# EAGLE schematic electronica-dextris (EAGLE 9.0.1)
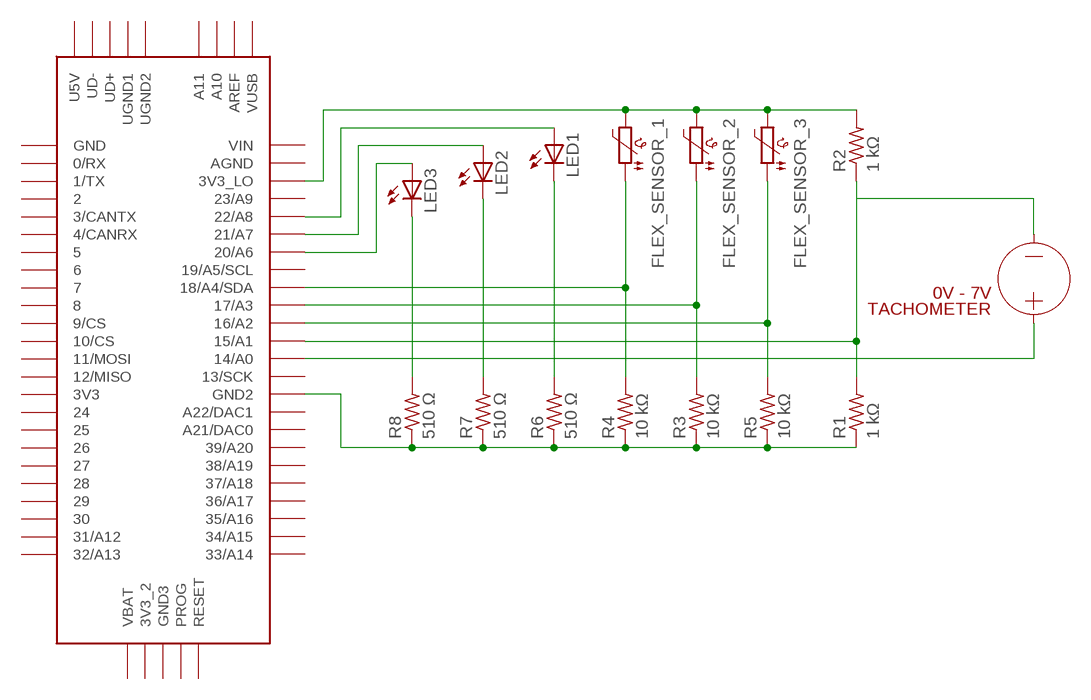
[diagram p0: schematic, sheet 1]

## Parts
FLEX_SENSOR_1  PTC-SOD70  [SOD70]
FLEX_SENSOR_2  PTC-SOD70  [SOD70]
FLEX_SENSOR_3  PTC-SOD70  [SOD70]
LED1  LED_E  [LED_1206]
LED2  LED_E  [LED_1206]
LED3  LED_E  [LED_1206]
R1  1 kΩ  R-US_0414/15  [0414/15]
R2  1 kΩ  R-US_0414/15  [0414/15]
R3  10 kΩ  R-US_0414/15  [0414/15]
R4  10 kΩ  R-US_0414/15  [0414/15]
R5  10 kΩ  R-US_0414/15  [0414/15]
R6  510 Ω  R-US_0414/15  [0414/15]
R7  510 Ω  R-US_0414/15  [0414/15]
R8  510 Ω  R-US_0414/15  [0414/15]
TACHOMETER  0V - 7V  NONLIN_ASRC  (no package)
U$1  TEENSY_3.5/3.6  [TEENSY_3.5/3.6]

## Nets
N$1: FLEX_SENSOR_1.1 R4.2 U$1.18/A4/SDA
N$2: FLEX_SENSOR_2.1 R3.2 U$1.17/A3
N$3: FLEX_SENSOR_3.1 R5.2 U$1.16/A2
N$4: LED1.C R6.2
N$5: LED2.C R7.2
N$6: LED3.C R8.2
N$8: TACHOMETER.+ U$1.14/A0
N$9: R1.1 R3.1 R4.1 R5.1 R6.1 R7.1 R8.1 U$1.GND2
N$10: FLEX_SENSOR_1.2 FLEX_SENSOR_2.2 FLEX_SENSOR_3.2 R2.2 U$1.3V3_LO
N$11: LED3.A U$1.20/A6
N$12: LED2.A U$1.21/A7
N$13: LED1.A U$1.22/A8
N$14: R1.2 R2.1 TACHOMETER.- U$1.15/A1
Unconnected: U$1.0/RX U$1.1/TX U$1.2 U$1.3/CANTX U$1.3V3 U$1.3V3_2 U$1.4/CANRX U$1.5 U$1.6 U$1.7 U$1.8 U$1.9/CS U$1.10/CS U$1.11/MOSI U$1.12/MISO U$1.13/SCK U$1.19/A5/SCL U$1.21/DAC0(A21/DAC0) U$1.23/A9 U$1.24 U$1.25 U$1.26 U$1.27 U$1.28 U$1.29 U$1.30 U$1.31/A12 U$1.32/A13 U$1.33/A14 U$1.34/A15 U$1.35/A16 U$1.36/A17 U$1.37/A18 U$1.38/A19 U$1.39/A20 U$1.A10 U$1.A11 U$1.A22/DAC1 U$1.AGND U$1.AREF U$1.GND U$1.GND3 U$1.PROG U$1.RESET U$1.U5V U$1.UD+ U$1.UD- U$1.UGND1 U$1.UGND2 U$1.VBAT U$1.VIN U$1.VUSB

## Library data of the parts
FLEX_SENSOR_1-FLEX_SENSOR_3 = ptc-ntc:PTC-: Positive Temperature Coefficient Resistor (PTC) termistor Philips KTY81-210 - KTY81-252 Source: 153627-da-01-en-Temperatur-Sensor_KTY10-6_Philips.pdf; OC_FARNELL: unknown; OC_NEWARK: unknown
LED1-LED3 = eagle-ltspice:LED_E: LED Source: http://www.osram.convergy.de Source: www.luxeon.com Source: www.kingbright.com; SPICEMODEL: NONE; SPICEPREFIX: D; SPICETYPE: diode
R1-R8 = resistor:R-US_: RESISTOR, American symbol
TACHOMETER = ngspice-simulation:NONLIN_ASRC: Nonlinear dependent source (ASRC) BXXXXXXX n+ n− < i = e x p r > <v= e x p r > < t c 1 = v al u e > < t c 2 = v al u e ><temp= v al u e > <dtemp= v al u e >
U$1 = teensy:TEENSY_3.5/3.6